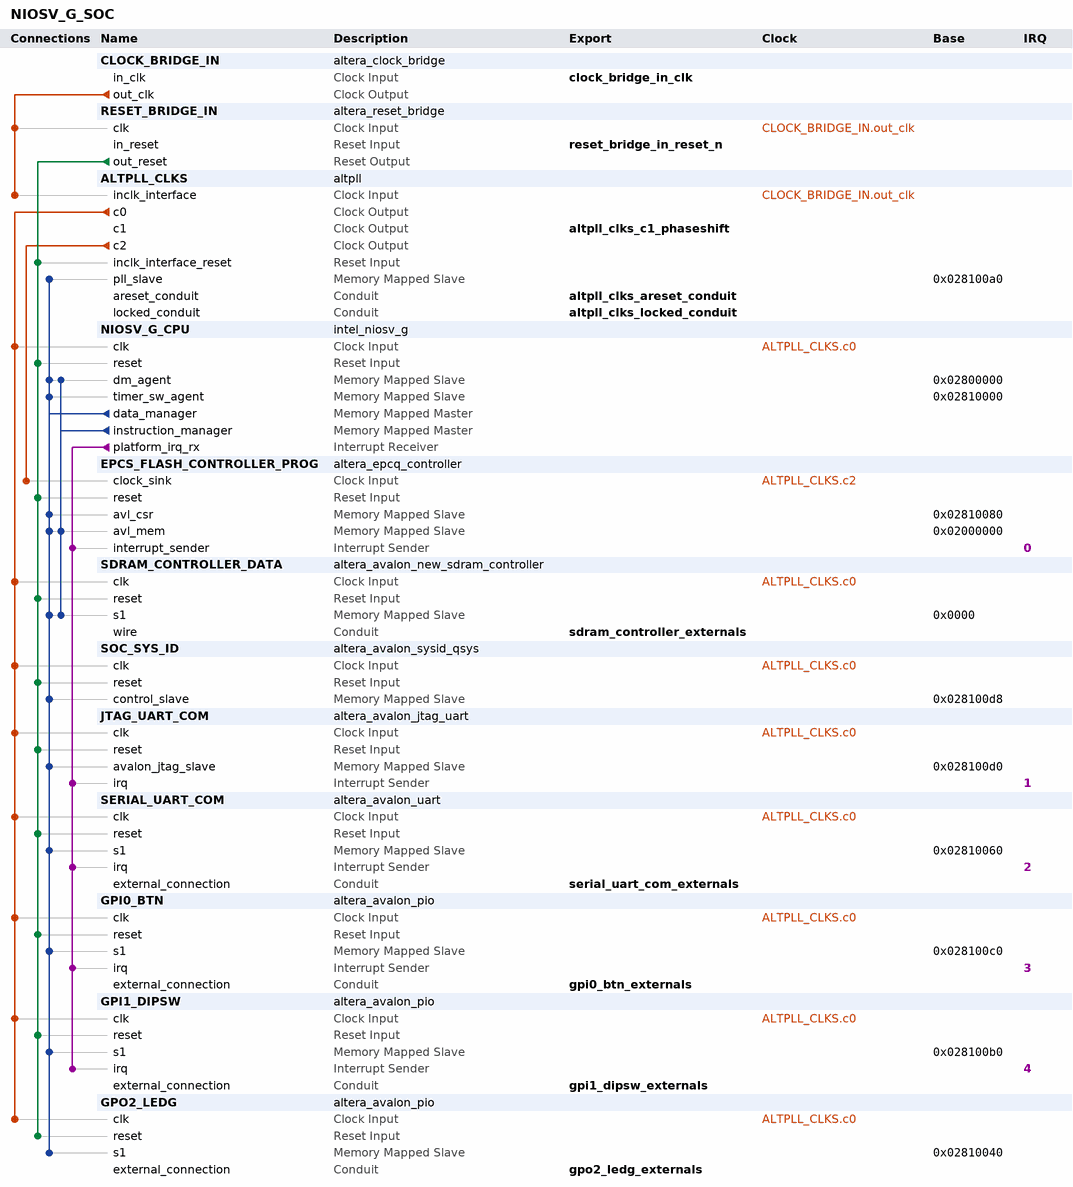
[diagram p0: system contents]
# Platform Designer (Qsys) system NIOSV_G_SOC, Cyclone IV E EP4CE22F17C6
# Parameters at their usual value, and those the tool derives, are not listed.
package require -exact qsys 23.1
create_system NIOSV_G_SOC
set_project_property DEVICE_FAMILY {Cyclone IV E}
set_project_property DEVICE EP4CE22F17C6

add_instance CLOCK_BRIDGE_IN altera_clock_bridge 23.1
set_instance_parameter_value CLOCK_BRIDGE_IN DERIVED_CLOCK_RATE 0
set_instance_parameter_value CLOCK_BRIDGE_IN EXPLICIT_CLOCK_RATE 50000000

add_instance RESET_BRIDGE_IN altera_reset_bridge 23.1
set_instance_parameter_value RESET_BRIDGE_IN ACTIVE_LOW_RESET 1
set_instance_parameter_value RESET_BRIDGE_IN SYNCHRONOUS_EDGES deassert

add_instance ALTPLL_CLKS altpll 23.1
set_instance_parameter_value ALTPLL_CLKS CLK0_DIVIDE_BY 1
set_instance_parameter_value ALTPLL_CLKS CLK0_MULTIPLY_BY 2
set_instance_parameter_value ALTPLL_CLKS CLK1_DIVIDE_BY 1
set_instance_parameter_value ALTPLL_CLKS CLK1_DUTY_CYCLE 50
set_instance_parameter_value ALTPLL_CLKS CLK1_MULTIPLY_BY 2
set_instance_parameter_value ALTPLL_CLKS CLK1_PHASE_SHIFT -1667
set_instance_parameter_value ALTPLL_CLKS CLK2_DIVIDE_BY 2
set_instance_parameter_value ALTPLL_CLKS CLK2_DUTY_CYCLE 50
set_instance_parameter_value ALTPLL_CLKS CLK2_MULTIPLY_BY 1
set_instance_parameter_value ALTPLL_CLKS CLK2_PHASE_SHIFT 0
set_instance_parameter_value ALTPLL_CLKS INCLK0_INPUT_FREQUENCY 20000
set_instance_parameter_value ALTPLL_CLKS PORT_ARESET PORT_USED
set_instance_parameter_value ALTPLL_CLKS PORT_LOCKED PORT_USED
set_instance_parameter_value ALTPLL_CLKS PORT_clk1 PORT_USED
set_instance_parameter_value ALTPLL_CLKS PORT_clk2 PORT_USED
set_instance_parameter_value ALTPLL_CLKS PORT_clk3 PORT_UNUSED

add_instance NIOSV_G_CPU intel_niosv_g 1.1.0
set_instance_parameter_value NIOSV_G_CPU clockFrequency 100000000
set_instance_parameter_value NIOSV_G_CPU dataCacheSize 8192
set_instance_parameter_value NIOSV_G_CPU disableFsqrtFdiv true
set_instance_parameter_value NIOSV_G_CPU dtcm1Base 0
set_instance_parameter_value NIOSV_G_CPU dtcm1Size 0
set_instance_parameter_value NIOSV_G_CPU dtcm2Base 0
set_instance_parameter_value NIOSV_G_CPU dtcm2Size 0
set_instance_parameter_value NIOSV_G_CPU enableDebug true
set_instance_parameter_value NIOSV_G_CPU enableDebugReset false
set_instance_parameter_value NIOSV_G_CPU enableECCLite false
set_instance_parameter_value NIOSV_G_CPU enableFPU true
set_instance_parameter_value NIOSV_G_CPU enableMulDiv true
set_instance_parameter_value NIOSV_G_CPU instCacheSize 16384
set_instance_parameter_value NIOSV_G_CPU itcm1Base 0
set_instance_parameter_value NIOSV_G_CPU itcm1Size 0
set_instance_parameter_value NIOSV_G_CPU itcm2Base 0
set_instance_parameter_value NIOSV_G_CPU itcm2Size 0
set_instance_parameter_value NIOSV_G_CPU peripheralRegionABase 0
set_instance_parameter_value NIOSV_G_CPU peripheralRegionASize 0
set_instance_parameter_value NIOSV_G_CPU peripheralRegionBBase 0
set_instance_parameter_value NIOSV_G_CPU peripheralRegionBSize 0
set_instance_parameter_value NIOSV_G_CPU resetOffset 1048576
set_instance_parameter_value NIOSV_G_CPU resetSlave EPCS_FLASH_CONTROLLER_PROG.avl_mem
set_instance_parameter_value NIOSV_G_CPU useResetReq false

add_instance EPCS_FLASH_CONTROLLER_PROG altera_epcq_controller 23.1
set_instance_parameter_value EPCS_FLASH_CONTROLLER_PROG CHIP_SELS 1
set_instance_parameter_value EPCS_FLASH_CONTROLLER_PROG DDASI 0
set_instance_parameter_value EPCS_FLASH_CONTROLLER_PROG FLASH_TYPE EPCS64
set_instance_parameter_value EPCS_FLASH_CONTROLLER_PROG IO_MODE STANDARD
set_instance_parameter_value EPCS_FLASH_CONTROLLER_PROG UNIQUE_ID {$${FILENAME}_EPCS_FLASH_CONTROLLER_PROG}
set_instance_parameter_value EPCS_FLASH_CONTROLLER_PROG clkFreq 25000000

add_instance SDRAM_CONTROLLER_DATA altera_avalon_new_sdram_controller 20.1
set_instance_parameter_value SDRAM_CONTROLLER_DATA TAC 5.5
set_instance_parameter_value SDRAM_CONTROLLER_DATA TRCD 20.0
set_instance_parameter_value SDRAM_CONTROLLER_DATA TRP 20.0
set_instance_parameter_value SDRAM_CONTROLLER_DATA casLatency 3
set_instance_parameter_value SDRAM_CONTROLLER_DATA columnWidth 9
set_instance_parameter_value SDRAM_CONTROLLER_DATA dataWidth 16
set_instance_parameter_value SDRAM_CONTROLLER_DATA generateSimulationModel true
set_instance_parameter_value SDRAM_CONTROLLER_DATA model single_Micron_MT48LC4M32B2_7_chip
set_instance_parameter_value SDRAM_CONTROLLER_DATA numberOfBanks 4
set_instance_parameter_value SDRAM_CONTROLLER_DATA numberOfChipSelects 1
set_instance_parameter_value SDRAM_CONTROLLER_DATA powerUpDelay 100.0
set_instance_parameter_value SDRAM_CONTROLLER_DATA refreshPeriod 15.625
set_instance_parameter_value SDRAM_CONTROLLER_DATA rowWidth 13

add_instance SOC_SYS_ID altera_avalon_sysid_qsys 23.1
set_instance_parameter_value SOC_SYS_ID id 14550284

add_instance JTAG_UART_COM altera_avalon_jtag_uart 23.1
set_instance_parameter_value JTAG_UART_COM readBufferDepth 128
set_instance_parameter_value JTAG_UART_COM simInteractiveOptions NO_INTERACTIVE_WINDOWS
set_instance_parameter_value JTAG_UART_COM writeBufferDepth 128

add_instance SERIAL_UART_COM altera_avalon_uart 23.1
set_instance_parameter_value SERIAL_UART_COM baud 115200
set_instance_parameter_value SERIAL_UART_COM dataBits 8
set_instance_parameter_value SERIAL_UART_COM fixedBaud true
set_instance_parameter_value SERIAL_UART_COM parity NONE
set_instance_parameter_value SERIAL_UART_COM stopBits 1

add_instance GPI0_BTN altera_avalon_pio 23.1
set_instance_parameter_value GPI0_BTN bitClearingEdgeCapReg true
set_instance_parameter_value GPI0_BTN captureEdge true
set_instance_parameter_value GPI0_BTN direction Input
set_instance_parameter_value GPI0_BTN edgeType FALLING
set_instance_parameter_value GPI0_BTN generateIRQ true
set_instance_parameter_value GPI0_BTN irqType EDGE
set_instance_parameter_value GPI0_BTN simDoTestBenchWiring true
set_instance_parameter_value GPI0_BTN width 1

add_instance GPI1_DIPSW altera_avalon_pio 23.1
set_instance_parameter_value GPI1_DIPSW bitClearingEdgeCapReg true
set_instance_parameter_value GPI1_DIPSW captureEdge true
set_instance_parameter_value GPI1_DIPSW direction Input
set_instance_parameter_value GPI1_DIPSW edgeType ANY
set_instance_parameter_value GPI1_DIPSW generateIRQ true
set_instance_parameter_value GPI1_DIPSW irqType EDGE
set_instance_parameter_value GPI1_DIPSW simDoTestBenchWiring true
set_instance_parameter_value GPI1_DIPSW width 4

add_instance GPO2_LEDG altera_avalon_pio 23.1
set_instance_parameter_value GPO2_LEDG bitModifyingOutReg true
set_instance_parameter_value GPO2_LEDG direction Output
set_instance_parameter_value GPO2_LEDG width 8

# connections
add_connection ALTPLL_CLKS.c0 GPI0_BTN.clk clock
add_connection ALTPLL_CLKS.c0 GPI1_DIPSW.clk clock
add_connection ALTPLL_CLKS.c0 GPO2_LEDG.clk clock
add_connection ALTPLL_CLKS.c0 JTAG_UART_COM.clk clock
add_connection ALTPLL_CLKS.c0 NIOSV_G_CPU.clk clock
add_connection ALTPLL_CLKS.c0 SDRAM_CONTROLLER_DATA.clk clock
add_connection ALTPLL_CLKS.c0 SERIAL_UART_COM.clk clock
add_connection ALTPLL_CLKS.c0 SOC_SYS_ID.clk clock
add_connection ALTPLL_CLKS.c2 EPCS_FLASH_CONTROLLER_PROG.clock_sink clock
add_connection CLOCK_BRIDGE_IN.out_clk ALTPLL_CLKS.inclk_interface clock
add_connection CLOCK_BRIDGE_IN.out_clk RESET_BRIDGE_IN.clk clock
add_connection RESET_BRIDGE_IN.out_reset ALTPLL_CLKS.inclk_interface_reset reset
add_connection RESET_BRIDGE_IN.out_reset EPCS_FLASH_CONTROLLER_PROG.reset reset
add_connection RESET_BRIDGE_IN.out_reset GPI0_BTN.reset reset
add_connection RESET_BRIDGE_IN.out_reset GPI1_DIPSW.reset reset
add_connection RESET_BRIDGE_IN.out_reset GPO2_LEDG.reset reset
add_connection RESET_BRIDGE_IN.out_reset JTAG_UART_COM.reset reset
add_connection RESET_BRIDGE_IN.out_reset NIOSV_G_CPU.reset reset
add_connection RESET_BRIDGE_IN.out_reset SDRAM_CONTROLLER_DATA.reset reset
add_connection RESET_BRIDGE_IN.out_reset SERIAL_UART_COM.reset reset
add_connection RESET_BRIDGE_IN.out_reset SOC_SYS_ID.reset reset
add_connection NIOSV_G_CPU.data_manager ALTPLL_CLKS.pll_slave avalon
set_connection_parameter_value NIOSV_G_CPU.data_manager/ALTPLL_CLKS.pll_slave baseAddress 0x028100a0
add_connection NIOSV_G_CPU.data_manager EPCS_FLASH_CONTROLLER_PROG.avl_csr avalon
set_connection_parameter_value NIOSV_G_CPU.data_manager/EPCS_FLASH_CONTROLLER_PROG.avl_csr baseAddress 0x02810080
add_connection NIOSV_G_CPU.data_manager EPCS_FLASH_CONTROLLER_PROG.avl_mem avalon
set_connection_parameter_value NIOSV_G_CPU.data_manager/EPCS_FLASH_CONTROLLER_PROG.avl_mem baseAddress 0x02000000
add_connection NIOSV_G_CPU.data_manager GPI0_BTN.s1 avalon
set_connection_parameter_value NIOSV_G_CPU.data_manager/GPI0_BTN.s1 baseAddress 0x028100c0
add_connection NIOSV_G_CPU.data_manager GPI1_DIPSW.s1 avalon
set_connection_parameter_value NIOSV_G_CPU.data_manager/GPI1_DIPSW.s1 baseAddress 0x028100b0
add_connection NIOSV_G_CPU.data_manager GPO2_LEDG.s1 avalon
set_connection_parameter_value NIOSV_G_CPU.data_manager/GPO2_LEDG.s1 baseAddress 0x02810040
add_connection NIOSV_G_CPU.data_manager JTAG_UART_COM.avalon_jtag_slave avalon
set_connection_parameter_value NIOSV_G_CPU.data_manager/JTAG_UART_COM.avalon_jtag_slave baseAddress 0x028100d0
add_connection NIOSV_G_CPU.data_manager NIOSV_G_CPU.dm_agent avalon
set_connection_parameter_value NIOSV_G_CPU.data_manager/NIOSV_G_CPU.dm_agent baseAddress 0x02800000
add_connection NIOSV_G_CPU.data_manager NIOSV_G_CPU.timer_sw_agent avalon
set_connection_parameter_value NIOSV_G_CPU.data_manager/NIOSV_G_CPU.timer_sw_agent baseAddress 0x02810000
add_connection NIOSV_G_CPU.data_manager SDRAM_CONTROLLER_DATA.s1 avalon
set_connection_parameter_value NIOSV_G_CPU.data_manager/SDRAM_CONTROLLER_DATA.s1 baseAddress 0x0000
add_connection NIOSV_G_CPU.data_manager SERIAL_UART_COM.s1 avalon
set_connection_parameter_value NIOSV_G_CPU.data_manager/SERIAL_UART_COM.s1 baseAddress 0x02810060
add_connection NIOSV_G_CPU.data_manager SOC_SYS_ID.control_slave avalon
set_connection_parameter_value NIOSV_G_CPU.data_manager/SOC_SYS_ID.control_slave baseAddress 0x028100d8
add_connection NIOSV_G_CPU.instruction_manager EPCS_FLASH_CONTROLLER_PROG.avl_mem avalon
set_connection_parameter_value NIOSV_G_CPU.instruction_manager/EPCS_FLASH_CONTROLLER_PROG.avl_mem baseAddress 0x02000000
add_connection NIOSV_G_CPU.instruction_manager NIOSV_G_CPU.dm_agent avalon
set_connection_parameter_value NIOSV_G_CPU.instruction_manager/NIOSV_G_CPU.dm_agent baseAddress 0x02800000
add_connection NIOSV_G_CPU.instruction_manager SDRAM_CONTROLLER_DATA.s1 avalon
set_connection_parameter_value NIOSV_G_CPU.instruction_manager/SDRAM_CONTROLLER_DATA.s1 baseAddress 0x0000
add_connection NIOSV_G_CPU.platform_irq_rx EPCS_FLASH_CONTROLLER_PROG.interrupt_sender interrupt
set_connection_parameter_value NIOSV_G_CPU.platform_irq_rx/EPCS_FLASH_CONTROLLER_PROG.interrupt_sender irqNumber 0
add_connection NIOSV_G_CPU.platform_irq_rx GPI0_BTN.irq interrupt
set_connection_parameter_value NIOSV_G_CPU.platform_irq_rx/GPI0_BTN.irq irqNumber 3
add_connection NIOSV_G_CPU.platform_irq_rx GPI1_DIPSW.irq interrupt
set_connection_parameter_value NIOSV_G_CPU.platform_irq_rx/GPI1_DIPSW.irq irqNumber 4
add_connection NIOSV_G_CPU.platform_irq_rx JTAG_UART_COM.irq interrupt
set_connection_parameter_value NIOSV_G_CPU.platform_irq_rx/JTAG_UART_COM.irq irqNumber 1
add_connection NIOSV_G_CPU.platform_irq_rx SERIAL_UART_COM.irq interrupt
set_connection_parameter_value NIOSV_G_CPU.platform_irq_rx/SERIAL_UART_COM.irq irqNumber 2

# exported interfaces
add_interface altpll_clks_areset_conduit conduit end
set_interface_property altpll_clks_areset_conduit EXPORT_OF ALTPLL_CLKS.areset_conduit
add_interface altpll_clks_c1_phaseshift clock source
set_interface_property altpll_clks_c1_phaseshift EXPORT_OF ALTPLL_CLKS.c1
add_interface altpll_clks_locked_conduit conduit end
set_interface_property altpll_clks_locked_conduit EXPORT_OF ALTPLL_CLKS.locked_conduit
add_interface clock_bridge_in_clk clock sink
set_interface_property clock_bridge_in_clk EXPORT_OF CLOCK_BRIDGE_IN.in_clk
add_interface gpi0_btn_externals conduit end
set_interface_property gpi0_btn_externals EXPORT_OF GPI0_BTN.external_connection
add_interface gpi1_dipsw_externals conduit end
set_interface_property gpi1_dipsw_externals EXPORT_OF GPI1_DIPSW.external_connection
add_interface gpo2_ledg_externals conduit end
set_interface_property gpo2_ledg_externals EXPORT_OF GPO2_LEDG.external_connection
add_interface reset_bridge_in_reset_n reset sink
set_interface_property reset_bridge_in_reset_n EXPORT_OF RESET_BRIDGE_IN.in_reset
add_interface sdram_controller_externals conduit end
set_interface_property sdram_controller_externals EXPORT_OF SDRAM_CONTROLLER_DATA.wire
add_interface serial_uart_com_externals conduit end
set_interface_property serial_uart_com_externals EXPORT_OF SERIAL_UART_COM.external_connection

set_interconnect_requirement {$system} qsys_mm.clockCrossingAdapter HANDSHAKE
set_interconnect_requirement {$system} qsys_mm.enableEccProtection FALSE
set_interconnect_requirement {$system} qsys_mm.insertDefaultSlave FALSE
set_interconnect_requirement {$system} qsys_mm.maxAdditionalLatency 1

save_system NIOSV_G_SOC.qsys
